# EAGLE design ws2812_example (EAGLE 6.5.0)
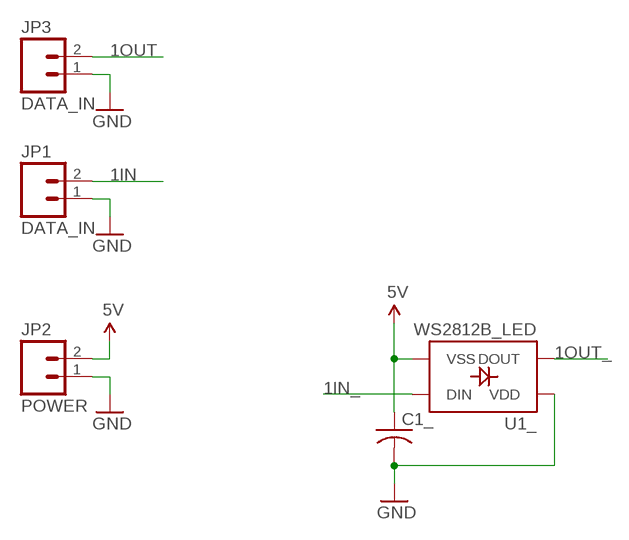
[diagram p0: schematic, sheet 1]

## Parts
C1_  C-USC0603K  [C0603K]
JP1  DATA_IN  M023.5MM_LOCK  [SCREWTERMINAL-3.5MM-2_LOCK]
JP2  POWER  M023.5MM_LOCK  [SCREWTERMINAL-3.5MM-2_LOCK]
JP3  DATA_IN  M023.5MM_LOCK  [SCREWTERMINAL-3.5MM-2_LOCK]
U1_  WS2812B_LED  [WS2812B_LED]

## Nets
1IN: JP1.2
1IN_: U1_.DIN
1OUT: JP3.2
1OUT_: U1_.DOUT
5V: C1_.1 JP2.2 U1_.VSS
GND: C1_.2 JP1.1 JP2.1 JP3.1 U1_.VDD

## Library data of the parts
C1_ = adafruit:C-US: CAPACITOR, American symbol
JP1-JP3 = SparkFun-Connectors:M02: Header 2 Standard 2-pin 0.1" header. Use with straight break away headers (SKU : PRT-00116), right angle break away headers (PRT-00553), swiss pins (PRT-00743), machine pins (PRT-00117), and female headers (PRT-00115). Molex polarized connector foot print use with SKU : PRT-08233 with associated crimp pins and housings.
U1_ = blinkinlabs:WS2812B_LED

## Board
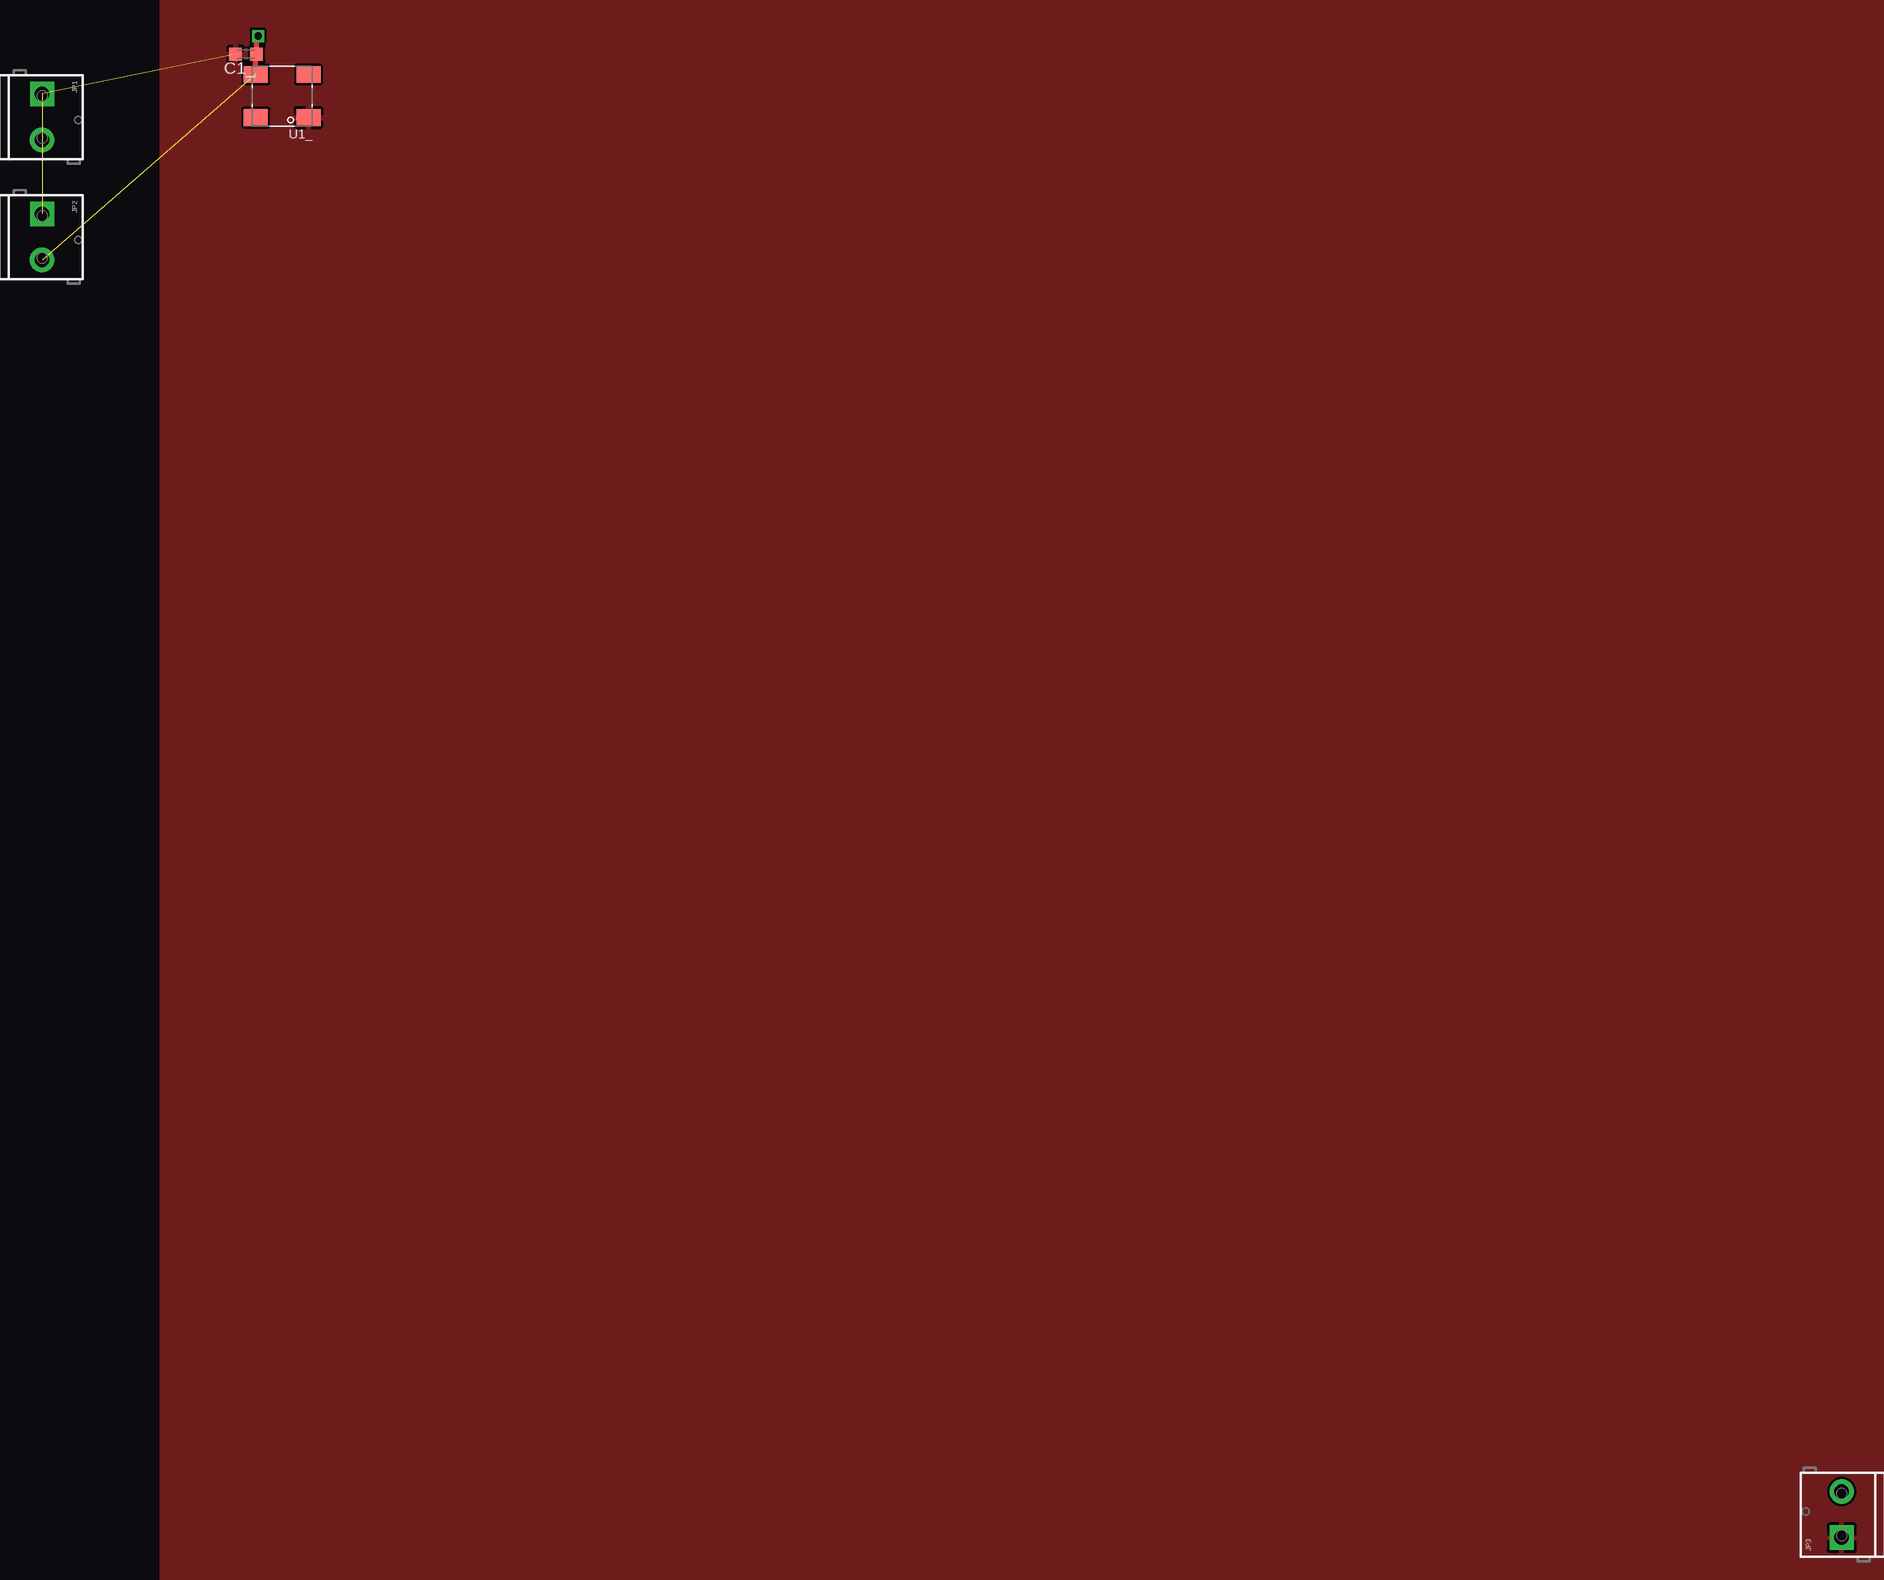
[diagram p1: board, top side]
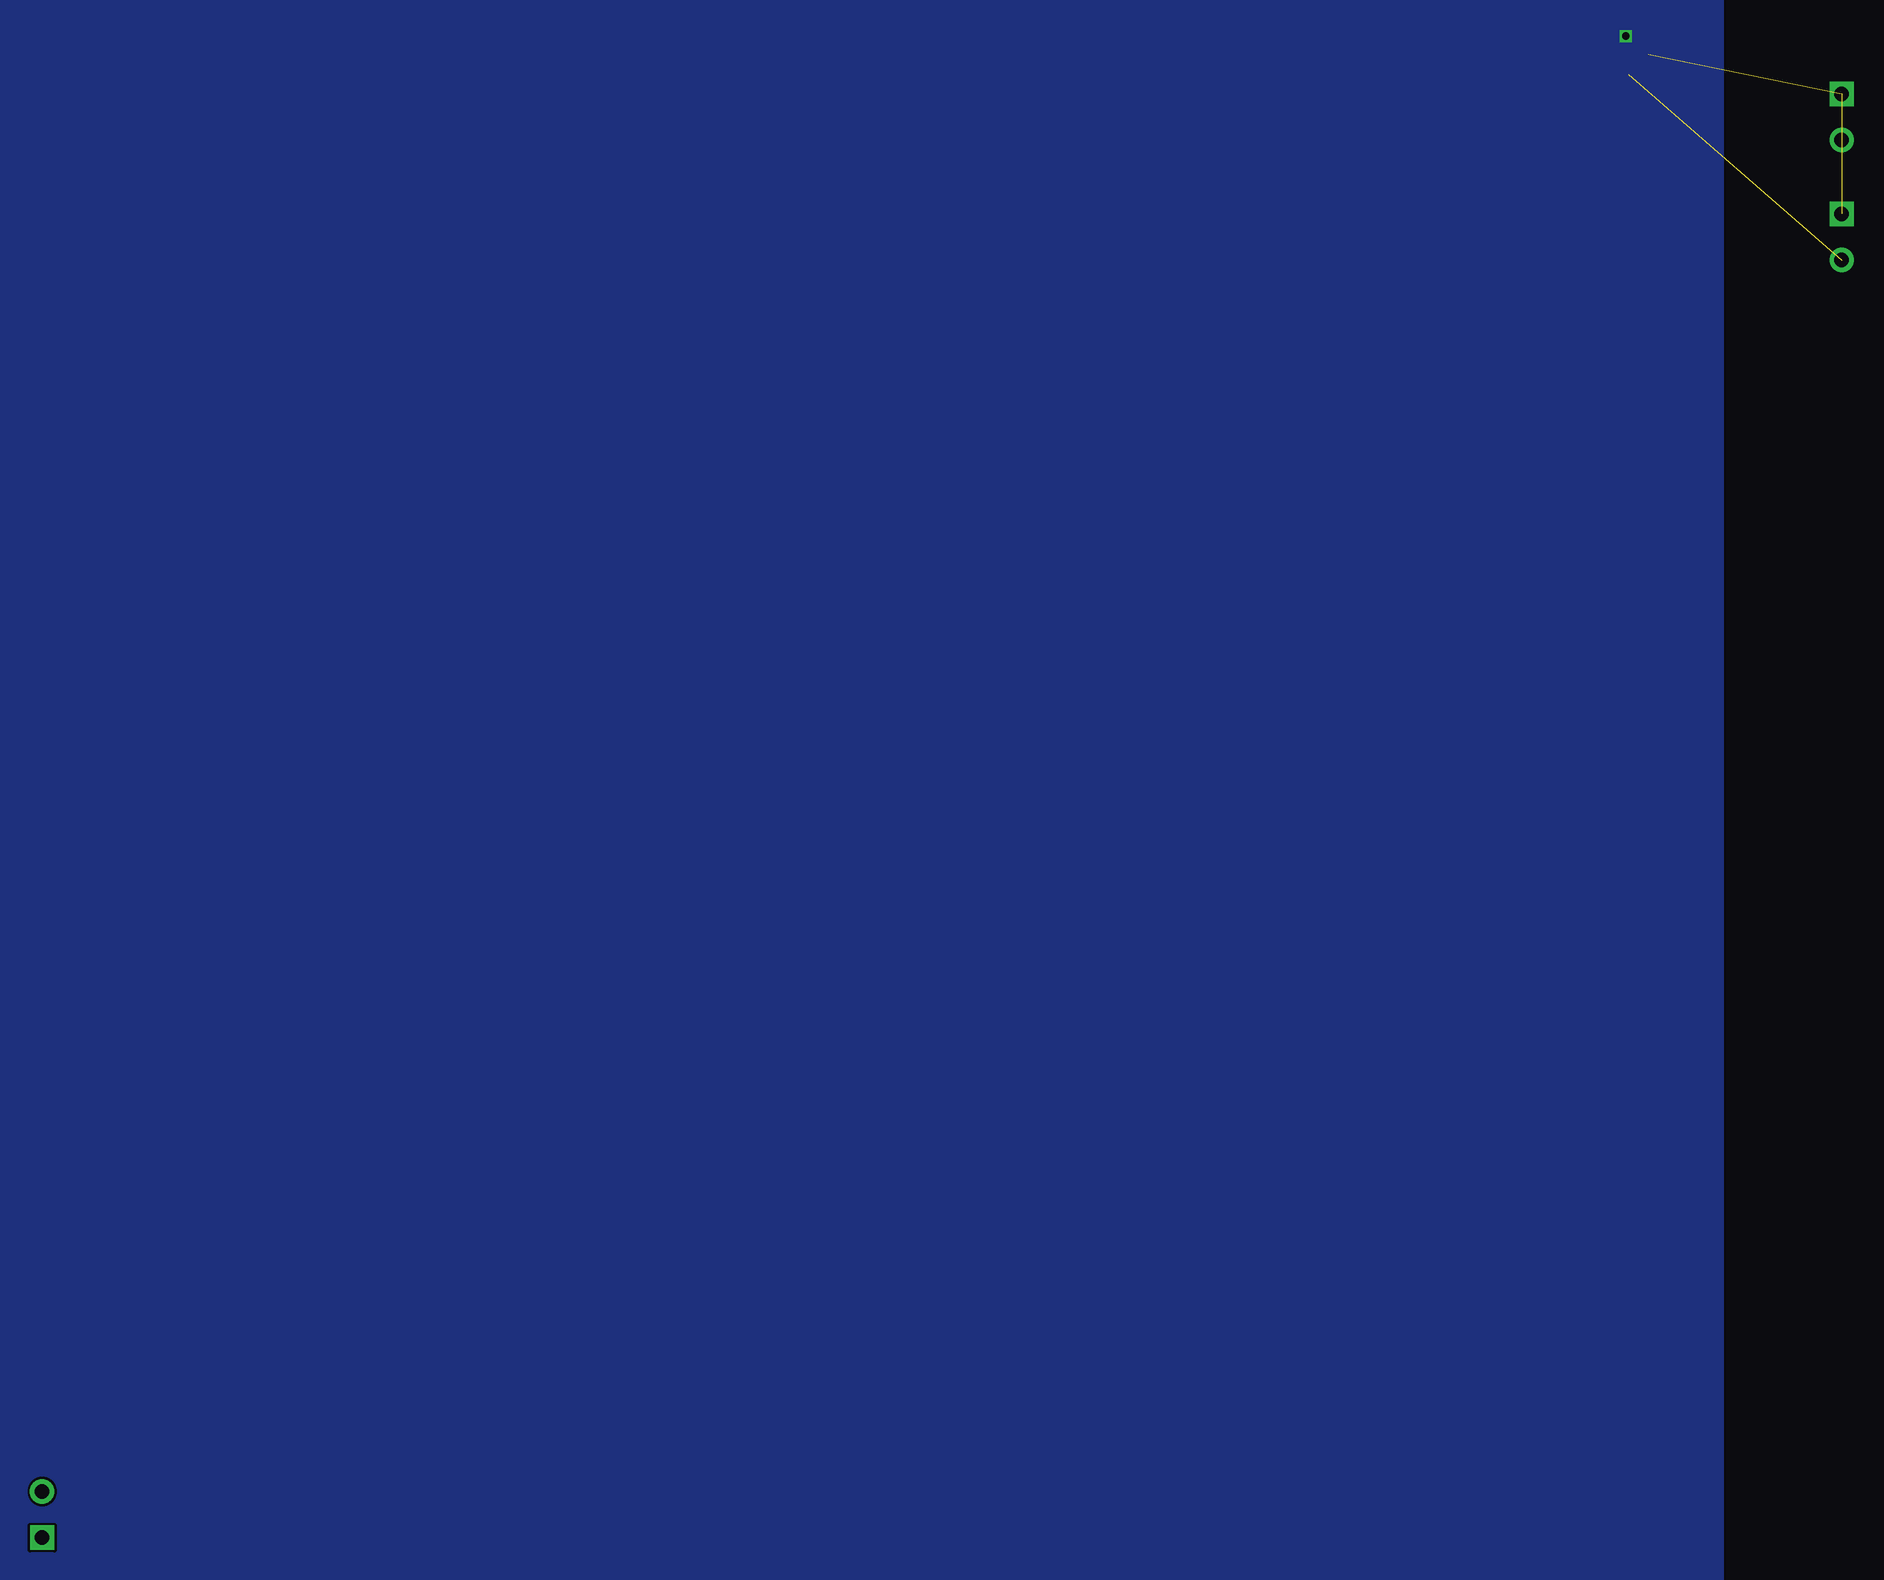
[diagram p2: board, bottom side, seen from below]

No outline drawn. Coordinates in mm, seen from the top.
Copper layers (1*16): Top 0.035mm / dielectric 1.5mm / Bottom 0.035mm
Design rules "default": minimum track width 10mil, minimum drill 24mil, track to track 8mil, track to pad 8mil, pad to pad 8mil, via to via 8mil, smd to smd 8mil, copper to edge 40mil, drill to drill 8mil, minimum pad ring 10mil, minimum via ring 8mil, stop-mask expansion 4mil, vias tented up to drill 0mil, thermal gap 10mil

### Footprints (pad centres in the part's own frame; a part is rotated, then mirrored left to right if it is on the bottom)
C0603K = smd 1.05 x 1.08: 1 -0.875,0; 2 0.875,0
SCREWTERMINAL-3.5MM-2_LOCK = drill 1.2 pad 2.032 square: 1 -0.178,0 | drill 1.2 pad 2.032: 2 3.678,0
WS2812B_LED = smd 2 x 1.4: DIN 2.2,1.8; DOUT -2.2,-1.8; VDD -2.2,1.8; VSS 2.2,-1.8

### Placement (x,y rotation side)
C1_  -3,3.5 180 top
JP1  -20,0 270 top
JP2  -20,-10 270 top
JP3  130,-120 90 top
U1_  0,0 180 top

### Tracks (layer width: path | path; a pad name or v marks a point on that pad's centre or on a via)
5V  (via drill 0.6)  (1 unrouted)
  Top 0.406: U1_.VSS -2.2,3.42 C1_.1 -2.12,4.88 v-2,5
  pour Bottom: -10,10 140,10 140,-130 -10,-130
GND  (2 unrouted)
  pour Top: -10,10 140,10 140,-130 -10,-130